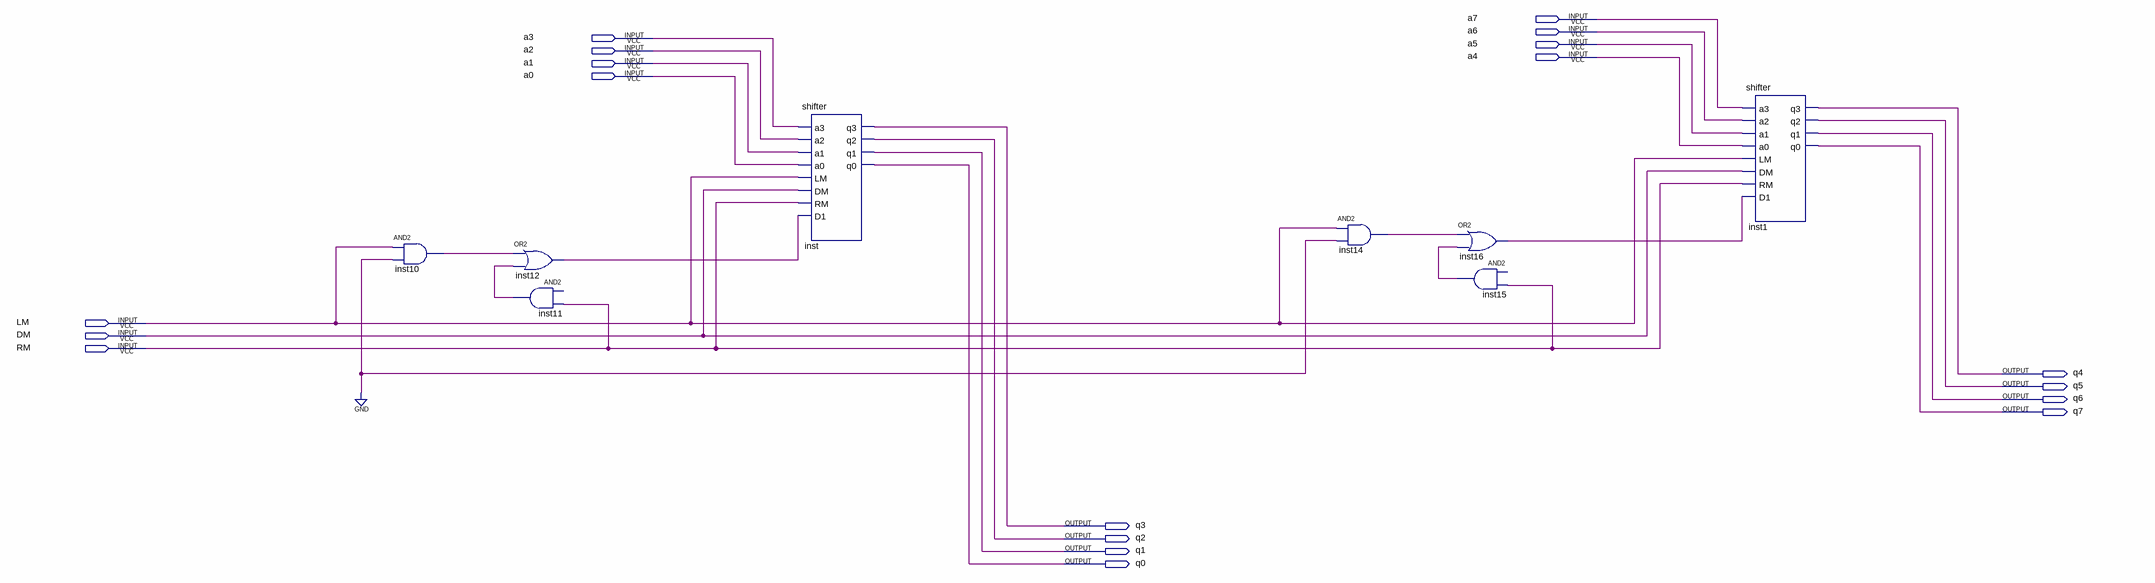
[diagram p0: schematic sheet]
// Quartus schematic shifter-8.bdf as structural Verilog: 8 symbols, 19 pins
module \shifter-8  (
  input  a7,
  input  a6,
  input  a3,
  input  a5,
  input  a2,
  input  a4,
  input  a1,
  input  a0,
  input  LM,
  input  DM,
  input  RM,
  output q4,
  output q5,
  output q6,
  output q7,
  output q3,
  output q2,
  output q1,
  output q0
);

  wire inst10_out, inst11_out, inst12_out, inst14_out, inst15_out, inst16_out;

  and inst10 (inst10_out, LM, 1'b0);
  or inst12 (inst12_out, inst10_out, inst11_out);
  buf inst11 (inst11_out, RM);  // AND2 open: IN1
  shifter inst (
    .a3(a3), .a2(a2), .a1(a1), .a0(a0), .LM(LM), .DM(DM), .RM(RM), .D1(inst12_out), .q3(q3), .q2(q2),
    .q1(q1), .q0(q0));
  and inst14 (inst14_out, LM, 1'b0);
  or inst16 (inst16_out, inst14_out, inst15_out);
  buf inst15 (inst15_out, RM);  // AND2 open: IN1
  shifter inst1 (
    .a3(a7), .a2(a6), .a1(a5), .a0(a4), .LM(LM), .DM(DM), .RM(RM), .D1(inst16_out), .q3(q4), .q2(q5),
    .q1(q6), .q0(q7));
endmodule
